# Altium schematic sheet Page_Tete.SchDoc: ClickBoard - Page Tête
size Letter; ApprovedBy: K.C.; Author: Antoine Perron; Organization: Cegep Limoilou; Address1: 1300, 8e Avenue; Address2: Québec, QC; Address3: Canada; Address4: G1J 5L5; Revision: B2; SheetNumber: 1; SheetTotal: 5
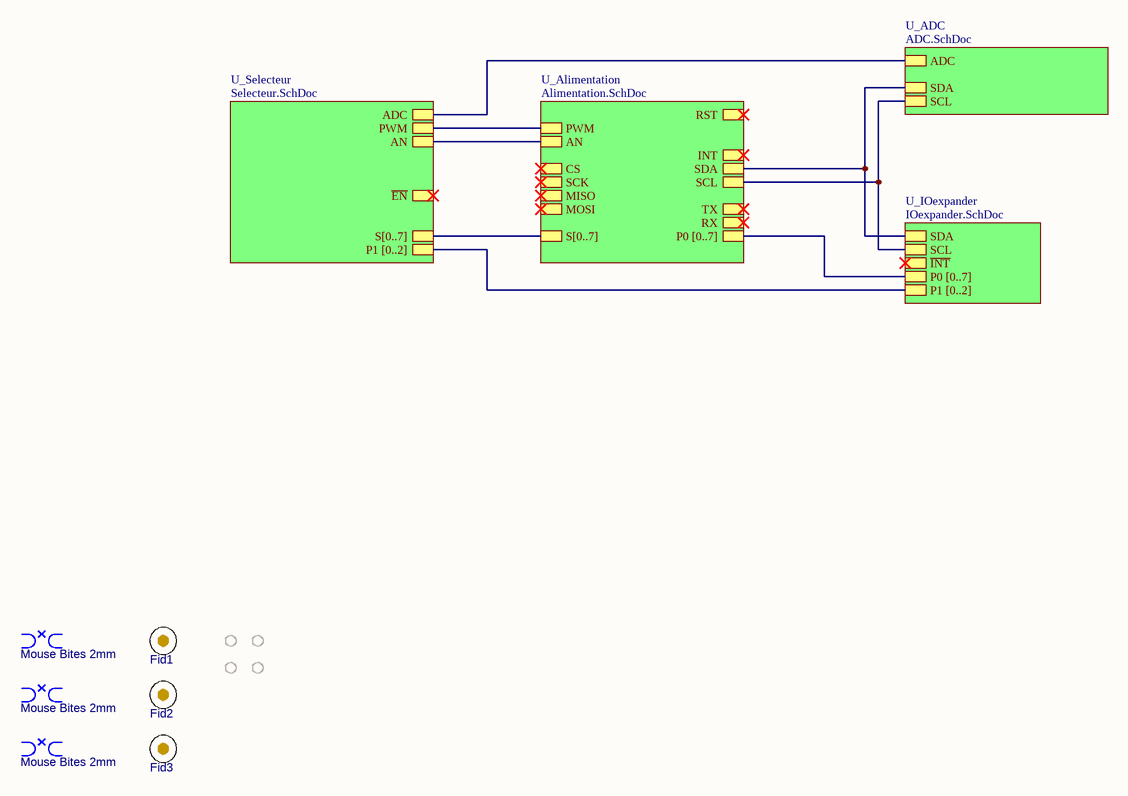
[diagram p0: Page_Tete.SchDoc]

## Parts
BRK1  value Mouse Bites 2mm  [BK_CRACK1B_M]  (hidden comment: DNP)  (no BOM)
BRK2  value Mouse Bites 2mm  [BK_CRACK1B_M]  (hidden comment: DNP)  (no BOM)
BRK3  value Mouse Bites 2mm  [BK_CRACK1B_M]  (hidden comment: DNP)  (no BOM)
Fid1  DNP  [FD_Fiducial]  (value not drawn)  (no BOM)
Fid2  DNP  [FD_Fiducial]  (value not drawn)  (no BOM)
Fid3  DNP  [FD_Fiducial]  (value not drawn)  (no BOM)
MH1  DNP  [MP_M-Hole_M2-NonPlated]  (value not drawn)  (no BOM)
MH2  DNP  [MP_M-Hole_M2-NonPlated]  (value not drawn)  (no BOM)
MH3  DNP  [MP_M-Hole_M2-NonPlated]  (value not drawn)  (no BOM)
MH4  DNP  [MP_M-Hole_M2-NonPlated]  (value not drawn)  (no BOM)

## Sub-sheets
U_ADC = ADC.SchDoc: SCL, SDA, ADC
U_Alimentation = Alimentation.SchDoc: SDA, SCL, S[0..7], P0 [0..7], MOSI, MISO, SCK, RST, PWM, CS, AN, RX, TX, INT
U_IOexpander = IOexpander.SchDoc: SDA, SCL, ~{INT}, P0 [0..7], P1 [0..2]
U_Selecteur = Selecteur.SchDoc: ADC, ~{EN}, PWM, P1 [0..2], S[0..7], AN

## Nets
(unnamed): sheet U_ADC/SCL, sheet U_Alimentation/SCL, sheet U_IOexpander/SCL
(unnamed): sheet U_ADC/SDA, sheet U_Alimentation/SDA, sheet U_IOexpander/SDA
(unnamed): sheet U_ADC/ADC, sheet U_Selecteur/ADC
(unnamed): sheet U_Alimentation/PWM, sheet U_Selecteur/PWM
(unnamed): sheet U_Alimentation/AN, sheet U_Selecteur/AN

Not connected (* = marked no-connect by the designer): BRK1 1 2 3 4 5; BRK2 1 2 3 4 5; BRK3 1 2 3 4 5; Fid1 1 2 3 4 5; Fid2 1 2 3 4 5; Fid3 1 2 3 4 5

## Buses and harness runs
bus sheet U_Alimentation/P0 [0..7] = sheet U_IOexpander/P0 [0..7]
bus sheet U_Alimentation/S[0..7] = sheet U_Selecteur/S[0..7]
bus sheet U_IOexpander/P1 [0..2] = sheet U_Selecteur/P1 [0..2]

## Notes on the sheet
- Titre :
- Conception :
- Date :
- Approbation :
- Heure :
- Révision :
- Feuille
- de
- Fichier :

## Library data of the parts
BRK1-BRK3 = BK_BREAKOUT_2MM: Mouse Bites; Mounting Technology: N/A
Fid1-Fid3 = Fiducial: Fiducial mark for alignement and Pick&Place; Value: Fiducial mark; Mounting Technology: N/A
MH1-MH4 = MH-2MM_NP: Mounting Hole 2mm non plated; Manufacturer Part Number 1: DNP; Mounting Technology: N/A; Value: Mounting Hole 2mm non plated; Supplier Part Number 1: N/A